# Altium project mother board.PrjPcb
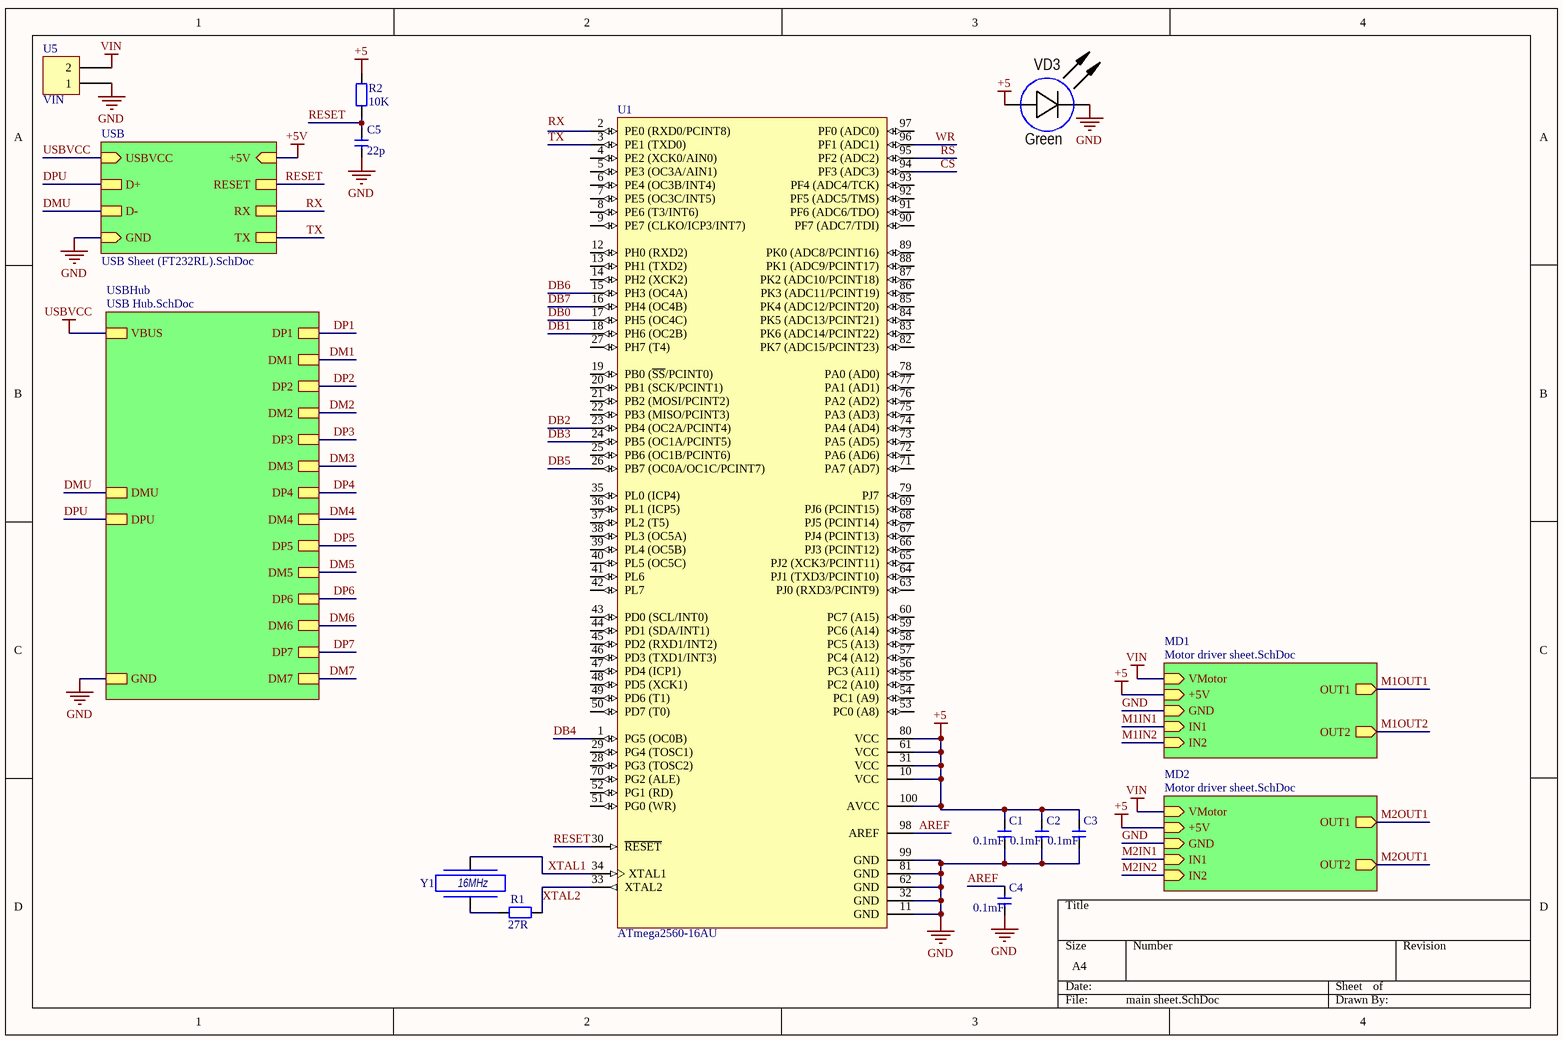
[diagram p0: main sheet.SchDoc]
4 sheets, 39 parts. Net scope: hierarchical (ports join the sheet entries above them; power ports are global).
Sheets:
  main sheet.SchDoc
    USB = USB Sheet (FT232RL).SchDoc
    USBHub = USB Hub.SchDoc
    MD1 = Motor driver sheet.SchDoc
    MD2 = Motor driver sheet.SchDoc

## Sheet main sheet.SchDoc
size A4

### Parts
C1  0.1mF  [cap0402]
C2  0.1mF  [cap0402]
C3  0.1mF  [cap0402]
C4  0.1mF  [cap0402]
C5  22p  [cap0603]
R1  27R  [res0603]
R2  10K  [res0603]
U1  ATmega2560-16AU  [100A_N]
U5  VIN  [Power connectors]
VD3  Green  [CH0603LB]
Y1  16MHz  [QSMD5.0x3.2x1.0]

### Sub-sheets
MD1 = Motor driver sheet.SchDoc: VMotor (in), +5V (in), GND (in), IN1 (in), IN2 (in), OUT1 (out), OUT2 (out)
MD2 = Motor driver sheet.SchDoc: VMotor (in), +5V (in), GND (in), IN1 (in), IN2 (in), OUT1 (out), OUT2 (out)
USB = USB Sheet (FT232RL).SchDoc: RX, TX, RESET, +5V (in), USBVCC (in), D+, D-, GND (in)
USBHub = USB Hub.SchDoc: VBUS, DMU, DPU, GND, DM1, DM2, DM3, DM4, DM5, DM6, DM7, DP1, DP2, DP3, DP4, DP5, DP6, DP7

### Nets
+5V: C1.2 C2.2 C3.2 R2.2 U1.10(VCC) U1.31(VCC) U1.61(VCC) U1.80(VCC) U1.100(AVCC) VD3.1(A) ; sheet USB/+5V, sheet MD1/+5V, sheet MD2/+5V  [also labelled +5]
GND: C1.1 C2.1 C3.1 C4.1 C5.1 U1.11(GND) U1.32(GND) U1.62(GND) U1.81(GND) U1.99(GND) U5.1 VD3.2(C) ; sheet USB/GND, sheet USBHub/GND, sheet MD1/GND, sheet MD2/GND
USBVCC: sheet USB/USBVCC, sheet USBHub/VBUS
VIN: U5.2 ; sheet MD1/VMotor, sheet MD2/VMotor  [project net VMotor]
AREF: C4.2 U1.98(AREF)
CS: U1.94(PF3_(ADC3))
DB0: U1.17(PH5_(OC4C))
DB1: U1.18(PH6_(OC2B))
DB2: U1.23(PB4_(OC2A/PCINT4))
DB3: U1.24(PB5_(OC1A/PCINT5))
DB4: U1.1(PG5_(OC0B))
DB5: U1.26(PB7_(OC0A/OC1C/PCINT7))
DB6: U1.15(PH3_(OC4A))
DB7: U1.16(PH4_(OC4B))
DMU: sheet USB/D-, sheet USBHub/DMU  [project net D-]
DPU: sheet USB/D+, sheet USBHub/DPU  [project net D+]
M2OUT1: sheet MD2/OUT1, sheet MD2/OUT2
RESET: C5.2 R2.1 U1.30(~{RESET}) ; sheet USB/RESET
RS: U1.95(PF2_(ADC2))
TX: U1.3(PE1_(TXD0)) ; sheet USB/TX  [project net PE1]
WR: U1.96(PF1_(ADC1))
XTAL1: U1.34(XTAL1) Y1.2
XTAL2: R1.2 U1.33(XTAL2)
NetR1_1: R1.1 Y1.1

Not connected (* = marked no-connect by the designer): U1 2(PE0_(RXD0/PCINT8)) 4(PE2_(XCK0/AIN0)) 5(PE3_(OC3A/AIN1)) 6(PE4_(OC3B/INT4)) 7(PE5_(OC3C/INT5)) 8(PE6_(T3/INT6)) 9(PE7_(CLKO/ICP3/INT7)) 12(PH0_(RXD2)) 13(PH1_(TXD2)) 14(PH2_(XCK2)) 19(PB0_(~{SS}/PCINT0)) 20(PB1_(SCK/PCINT1)) 21(PB2_(MOSI/PCINT2)) 22(PB3_(MISO/PCINT3)) 25(PB6_(OC1B/PCINT6)) 27(PH7_(T4)) 28(PG3_(TOSC2)) 29(PG4_(TOSC1)) 35(PL0_(ICP4)) 36(PL1_(ICP5)) 37(PL2_(T5)) 38(PL3_(OC5A)) 39(PL4_(OC5B)) 40(PL5_(OC5C)) 41(PL6) 42(PL7) 43(PD0_(SCL/INT0)) 44(PD1_(SDA/INT1)) 45(PD2_(RXD1/INT2)) 46(PD3_(TXD1/INT3)) 47(PD4_(ICP1)) 48(PD5_(XCK1)) 49(PD6_(T1)) 50(PD7_(T0)) 51(PG0_(WR)) 52(PG1_(RD)) 53(PC0_(A8)) 54(PC1_(A9)) 55(PC2_(A10)) 56(PC3_(A11)) 57(PC4_(A12)) 58(PC5_(A13)) 59(PC6_(A14)) 60(PC7_(A15)) 63(PJ0_(RXD3/PCINT9)) 64(PJ1_(TXD3/PCINT10)) 65(PJ2_(XCK3/PCINT11)) 66(PJ3_(PCINT12)) 67(PJ4_(PCINT13)) 68(PJ5_(PCINT14)) 69(PJ6_(PCINT15)) 70(PG2_(ALE)) 71(PA7_(AD7)) 72(PA6_(AD6)) 73(PA5_(AD5)) 74(PA4_(AD4)) 75(PA3_(AD3)) 76(PA2_(AD2)) 77(PA1_(AD1)) 78(PA0_(AD0)) 79(PJ7) 82(PK7_(ADC15/PCINT23)) 83(PK6_(ADC14/PCINT22)) 84(PK5_(ADC13/PCINT21)) 85(PK4_(ADC12/PCINT20)) 86(PK3_(ADC11/PCINT19)) 87(PK2_(ADC10/PCINT18)) 88(PK1_(ADC9/PCINT17)) 89(PK0_(ADC8/PCINT16)) 90(PF7_(ADC7/TDI)) 91(PF6_(ADC6/TDO)) 92(PF5_(ADC5/TMS)) 93(PF4_(ADC4/TCK)) 97(PF0_(ADC0))

### Notes on the sheet
- Labels drawn without touching a wire or pin: RX

### Library data of the parts
C1-C5 = Cap SMD
R1 R2 = Resistor SMD
U1 = ATmega2560-16AU: 8-bit AVR Microcontroller, 4.5-5.5V, 256KB Flash, 4KB EEPROM, 8KB SRAM, 86 GPIO pins, 100-pin TQFP, Industrial Grade (-40°C to 85°C), Pb-Free; Published: 1-Apr-2010; DatasheetVersion: revL, Aug-2007; PackageVersion: revC, Oct-2001; PackageReference: 100A; Publisher: Altium Limited; PackageDescription: 100-Pin Thin Profile Plastic Quad Flat Pack (TQFP), 14 x 14 x 1.0 mm Body, 0.5 mm Pitch; Supplier 1: Digi-Key; Supplier Part Number 1: ATMEGA2560-16AU-ND; Supplier 2: Farnell; Supplier Part Number 2: 1288330; Supplier 3: Farnell; Supplier Part Number 3: 1661740; Supplier 4: Mouser; Supplier Part Number 4: 556-ATMEGA2560-16AU; Code_JEDEC: MS-026-AED; ComponentLink1Description: Manufacturer Link; ComponentLink1URL: http://www.atmel.com/products/avr/default.asp?; ComponentLink2Description: ATmega640/1280/1281/2560/2561 Datasheet; ComponentLink2URL: http://www.atmel.com/dyn/resources/prod_documents/doc2549.pdf; ComponentLink3Description: ATmega640/1280/1281/2560/2561 Summary; ComponentLink3URL: http://www.atmel.com/dyn/resources/prod_documents/2549S.pdf; ComponentLink4Description: Atmel.com Home; ComponentLink4URL: http://www.atmel.com
U5 = Power connectors
VD3 = LED: Manufacturer: *; Model: *; HelpURL: *; ComponentKind: *; Value: *
Y1 = Crystal: Кварцевый резонатор; Value: 16MHz

## Sheet USB Sheet (FT232RL).SchDoc
size A4
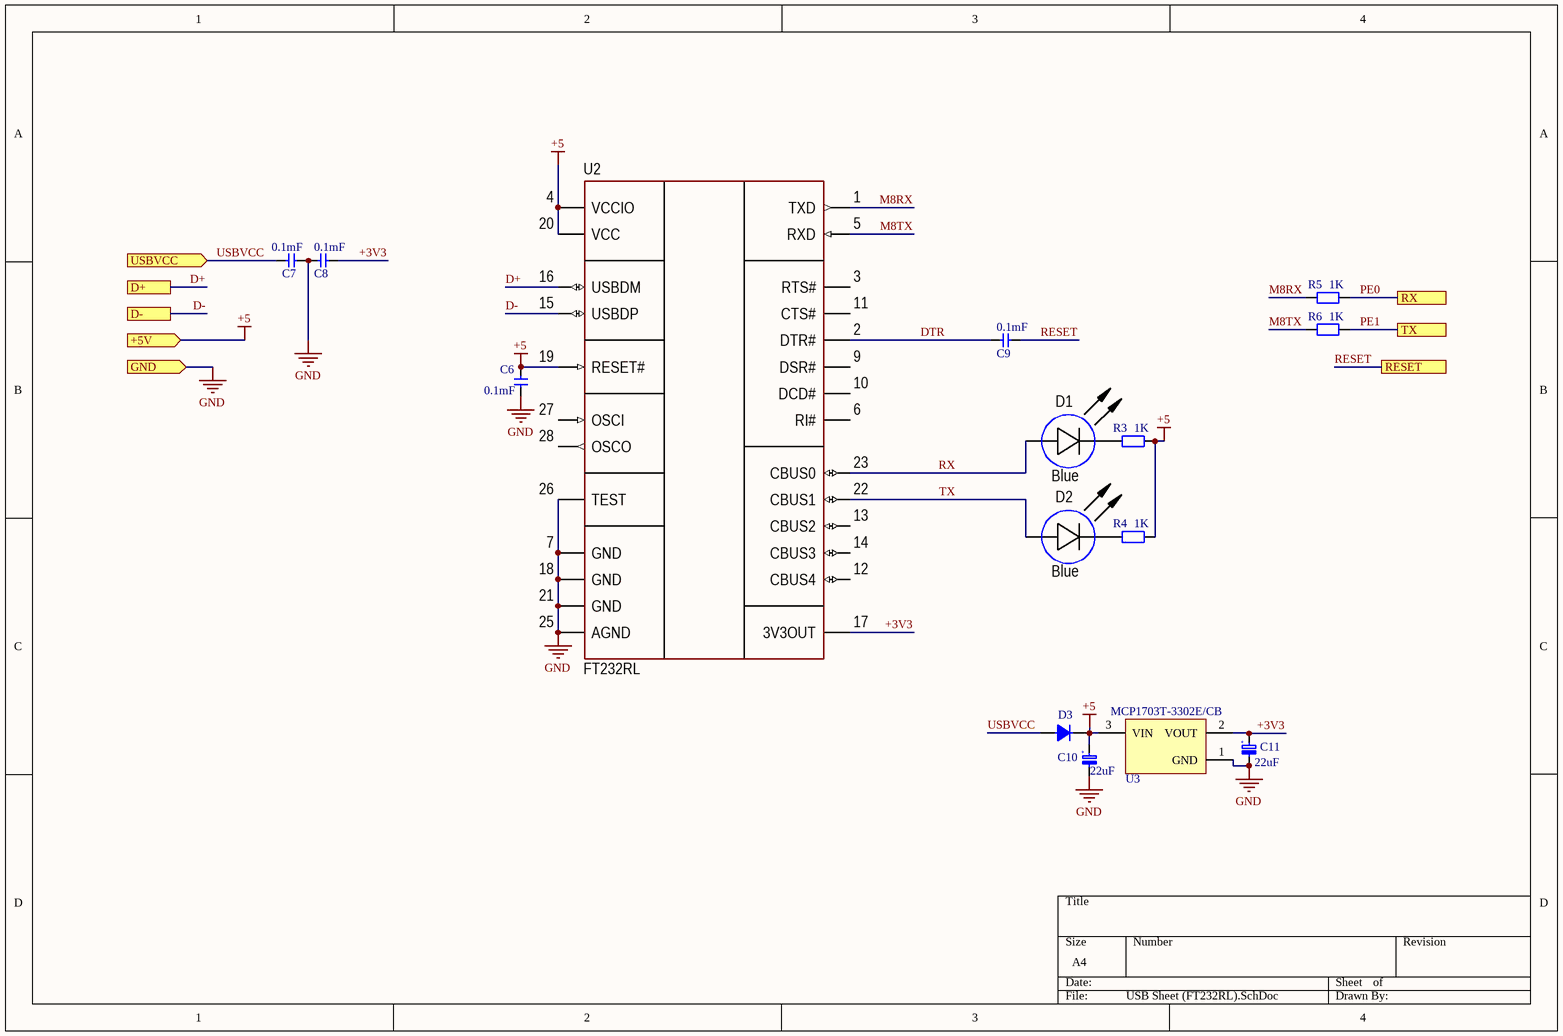
[diagram p1: USB Sheet (FT232RL).SchDoc]

### Parts
C6  0.1mF  [cap0603]
C7  0.1mF  [cap0603]
C8  0.1mF  [cap0603]
C9  0.1mF  [cap0603]
C10  22uF  [Tantal B]
C11  22uF  [Tantal B]
D1  Blue  [CH0805LB]
D2  Blue  [CH0805LB]
D3  Diode SMD  [SOD123]  (value not drawn)
R3  1K  [res0603]
R4  1K  [res0603]
R5  1K  [res0603]
R6  1K  [res0603]
U2  FT232RL  [28-SSOP]
U3  MCP1703T-3302E/CB  [SOT23-3_A]

### Ports
+5V (in), D+, D-, GND (in), RESET, RX, TX, USBVCC (in)

### Nets
+5: C6.2 C10.2(PLUS) D3.2 R3.2 R4.2 U2.4(VCCIO) U2.19(RESET#) U2.20(VCC) U3.3(VIN) ; port +5V  [project net +5V]
GND: C6.1 C7.2 C8.1 C10.1(MINUS) C11.1(MINUS) U2.7(GND) U2.18(GND) U2.21(GND) U2.25(AGND) U2.26(TEST) U3.1(GND) ; port GND
USBVCC: C7.1 D3.1 ; port USBVCC
+3V3: C8.2 C11.2(PLUS) U2.17(3V3OUT) U3.2(VOUT)
D+: U2.16(USBDM) ; port D+
D-: U2.15(USBDP) ; port D-
DTR: C9.1 U2.2(DTR#)
M8RX: R5.1 U2.1(TXD)
M8TX: R6.1 U2.5(RXD)
PE0: R5.2 ; port RX
PE1: R6.2 ; port TX
RESET: C9.2 ; port RESET
RX: D1.1(A) U2.23(CBUS0)
TX: D2.1(A) U2.22(CBUS1)
NetD1_2: D1.2(C) R3.1
NetD2_2: D2.2(C) R4.1

Not connected (* = marked no-connect by the designer): U2 3(RTS#) 6(RI#) 9(DSR#) 10(DCD#) 11(CTS#) 12(CBUS4) 13(CBUS2) 14(CBUS3) 27(OSCI) 28(OSCO)

### Notes on the sheet
- (in symbol Cap Tantal) +

### Library data of the parts
C6-C9 = Cap SMD
C10 C11 = Cap Tantal
D1 D2 = LED: Manufacturer: *; Model: *; HelpURL: *; ComponentKind: *; Value: *
R3-R6 = Resistor SMD
U2 = FT232RL: USB-UART; Manufacturer: FTDI, Future Technology Devices International Ltd; Model: FT232RL-REEL; HelpURL: https://www.digikey.com/product-detail/en/ftdi-future-technology-devices-international-ltd/FT232RL-REEL/768-1007-1-ND/1836402; ComponentKind: SSOP-28
U3 = MCP1703T-3302E/CB: 250 mA, 16V, Low Quiescent Current LDO Regulator, 3-Pin SOT-23A, Extended Temperature, Tape and Reel; Published: 29-Jan-2009; DatasheetVersion: revD, Sep-2009; PackageVersion: revBB, Aug-2009; PackageReference: SOT-23A-CB3; Publisher: Altium Limited; PackageDescription: 3-Lead Plastic Small Outline Transistor (CB) [SOT-23A]; Supplier 1: Digi-Key; Supplier Part Number 1: MCP1703T-3302E/CBTR-ND; Supplier 2: Digi-Key; Supplier Part Number 2: MCP1703T-3302E/CBCT-ND; Supplier 3: Digi-Key; Supplier Part Number 3: MCP1703T-3302E/CBDKR-ND; Supplier 4: Farnell; Supplier Part Number 4: 1439518; ComponentLink1Description: Datasheet; ComponentLink1URL: http://ww1.microchip.com/downloads/en/DeviceDoc/22049d.pdf; ComponentLink2Description: Packaging Specification; ComponentLink2URL: http://www.microchip.com/stellent/groups/techpub_sg/documents/packagingspec/en012702.pdf; ComponentLink3Description: Microchip.com Home; ComponentLink3URL: http://www.microchip.com/

## Sheet USB Hub.SchDoc
size A4
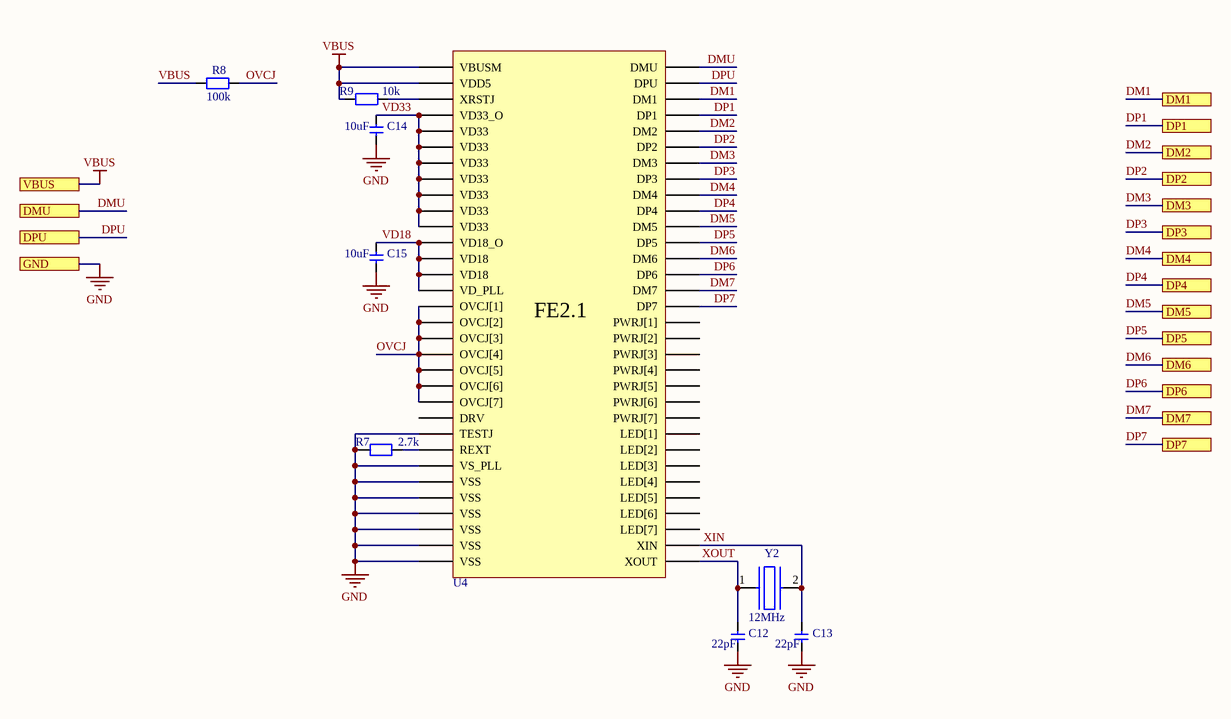
[diagram p2: USB Hub.SchDoc]

### Parts
C12  22pF  [cap0603]
C13  22pF  [cap0603]
C14  10uF  [cap0603]
C15  10uF  [cap0603]
R7  2.7k  [res0603]
R8  100k  [res0603]
R9  10k  [res0603]
U4  FE2.1  [LQFP64_N_1]  (value not drawn)
Y2  12MHz

### Ports
DM1, DM2, DM3, DM4, DM5, DM6, DM7, DMU, DP1, DP2, DP3, DP4, DP5, DP6, DP7, DPU, GND, VBUS

### Nets
GND: C12.1 C13.1 C14.1 C15.1 R7.1 U4.3(TESTJ) U4.11(VSS) U4.19(VSS) U4.25(VSS) U4.32(VS_PLL) U4.37(VSS) U4.43(VSS) U4.49(VSS) ; port GND
VBUS: R8.1 R9.1 U4.9(VDD5) U4.51(VBUSM) ; port VBUS  [project net USBVCC]
DM1: U4.26(DM1) ; port DM1
DM2: U4.23(DM2) ; port DM2
DM3: U4.20(DM3) ; port DM3
DM4: U4.17(DM4) ; port DM4
DM5: U4.41(DM5) ; port DM5
DM6: U4.44(DM6) ; port DM6
DM7: U4.47(DM7) ; port DM7
DMU: U4.38(DMU) ; port DMU  [project net D-]
DP1: U4.27(DP1) ; port DP1
DP2: U4.24(DP2) ; port DP2
DP3: U4.21(DP3) ; port DP3
DP4: U4.18(DP4) ; port DP4
DP5: U4.42(DP5) ; port DP5
DP6: U4.45(DP6) ; port DP6
DP7: U4.48(DP7) ; port DP7
DPU: U4.39(DPU) ; port DPU  [project net D+]
OVCJ: R8.2 U4.14(PWRJ[4]) U4.15(OVCJ[2]) U4.16(OVCJ[3]) U4.17(OVCJ[4]) U4.18(OVCJ[5]) U4.19(OVCJ[6]) U4.20(OVCJ[7])
VD18: C15.2 U4.7(VD18) U4.29(VD_PLL) U4.33(VD18_O) U4.36(VD18)
VD33: C14.2 U4.10(VD33_O) U4.16(VD33) U4.22(VD33) U4.28(VD33) U4.34(VD33) U4.40(VD33) U4.46(VD33) U4.56(VD33)
XIN: C13.2 U4.30(XIN) Y2.2
XOUT: C12.2 U4.31(XOUT) Y2.1
NetR7_2: R7.2 U4.35(REXT)
NetR9_2: R9.2 U4.50(XRSTJ)

Not connected (* = marked no-connect by the designer): U4 1(LED[5]) 2(DRV) 4(LED[1]) 5(LED[2]) 6(LED[3]) 8(LED[4]) 12(PWRJ[3]) 52(PWRJ[7]) 54(PWRJ[6]) 57(PWRJ[5]) 59(PWRJ[1]) 61(PWRJ[2]) 63(LED[7]) 64(LED[6])

### Library data of the parts
C12-C15 = Cap SMD
R7-R9 = Resistor SMD
Y2 = Quartz

## Sheet Motor driver sheet.SchDoc
size A4
Used 2 times, as channels MD1, MD2. Parts and nets are listed once, with the designators drawn on the sheet.
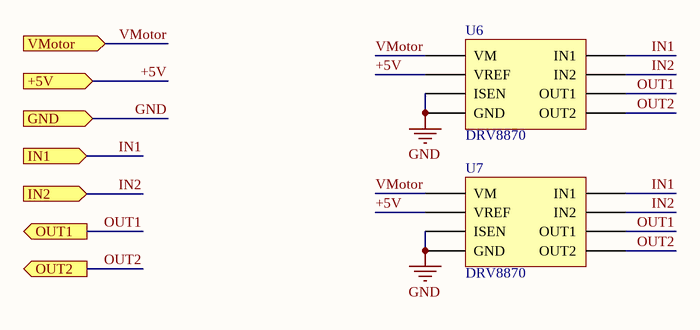
[diagram p3: Motor driver sheet.SchDoc]

### Parts
U6  DRV8870  [8-Pin HSOP]
U7  DRV8870  [8-Pin HSOP]

### Ports
+5V (in), GND (in), IN1 (in), IN2 (in), OUT1 (out), OUT2 (out), VMotor (in)

### Nets
GND: U6.1(GND) U6.7(ISEN) U7.1(GND) U7.7(ISEN) ; port GND
+5V: U6.4(VREF) U7.4(VREF) ; port +5V
IN1: U6.2(IN1) U7.2(IN1) ; port IN1
IN2: U6.3(IN2) U7.3(IN2) ; port IN2
OUT1: U6.6(OUT1) U7.6(OUT1) ; port OUT1
OUT2: U6.8(OUT2) U7.8(OUT2) ; port OUT2
VMotor: U6.5(VM) U7.5(VM) ; port VMotor

### Channels
MD1: designators end in _MD1; ports +5V=+5V GND=GND IN1=IN1_MD1 IN2=IN2_MD1 OUT1=M1OUT1 OUT2=M1OUT2 VMotor=VMotor
MD2: designators end in _MD2; ports +5V=+5V GND=GND IN1=IN1_MD2 IN2=IN2_MD2 OUT1=M2OUT1 OUT2=M2OUT1 VMotor=VMotor

## Nets that join several sheets
+5V: main sheet (10 pins), USB Sheet (FT232RL) (9 pins), MD1 (U6_MD1.4 U7_MD1.4), MD2 (U6_MD2.4 U7_MD2.4)
GND: main sheet (12 pins), USB Sheet (FT232RL) (11 pins), USB Hub (13 pins), MD1 (U6_MD1.1 U6_MD1.7 U7_MD1.1 U7_MD1.7), MD2 (U6_MD2.1 U6_MD2.7 U7_MD2.1 U7_MD2.7)
USBVCC: USB Sheet (FT232RL) (C7.1 D3.1), USB Hub (R8.1 R9.1 U4.9 U4.51)
VMotor: main sheet (U5.2), MD1 (U6_MD1.5 U7_MD1.5), MD2 (U6_MD2.5 U7_MD2.5)
D+: USB Sheet (FT232RL) (U2.16), USB Hub (U4.39)
D-: USB Sheet (FT232RL) (U2.15), USB Hub (U4.38)
PE1: main sheet (U1.3), USB Sheet (FT232RL) (R6.2)
RESET: main sheet (C5.2 R2.1 U1.30), USB Sheet (FT232RL) (C9.2)